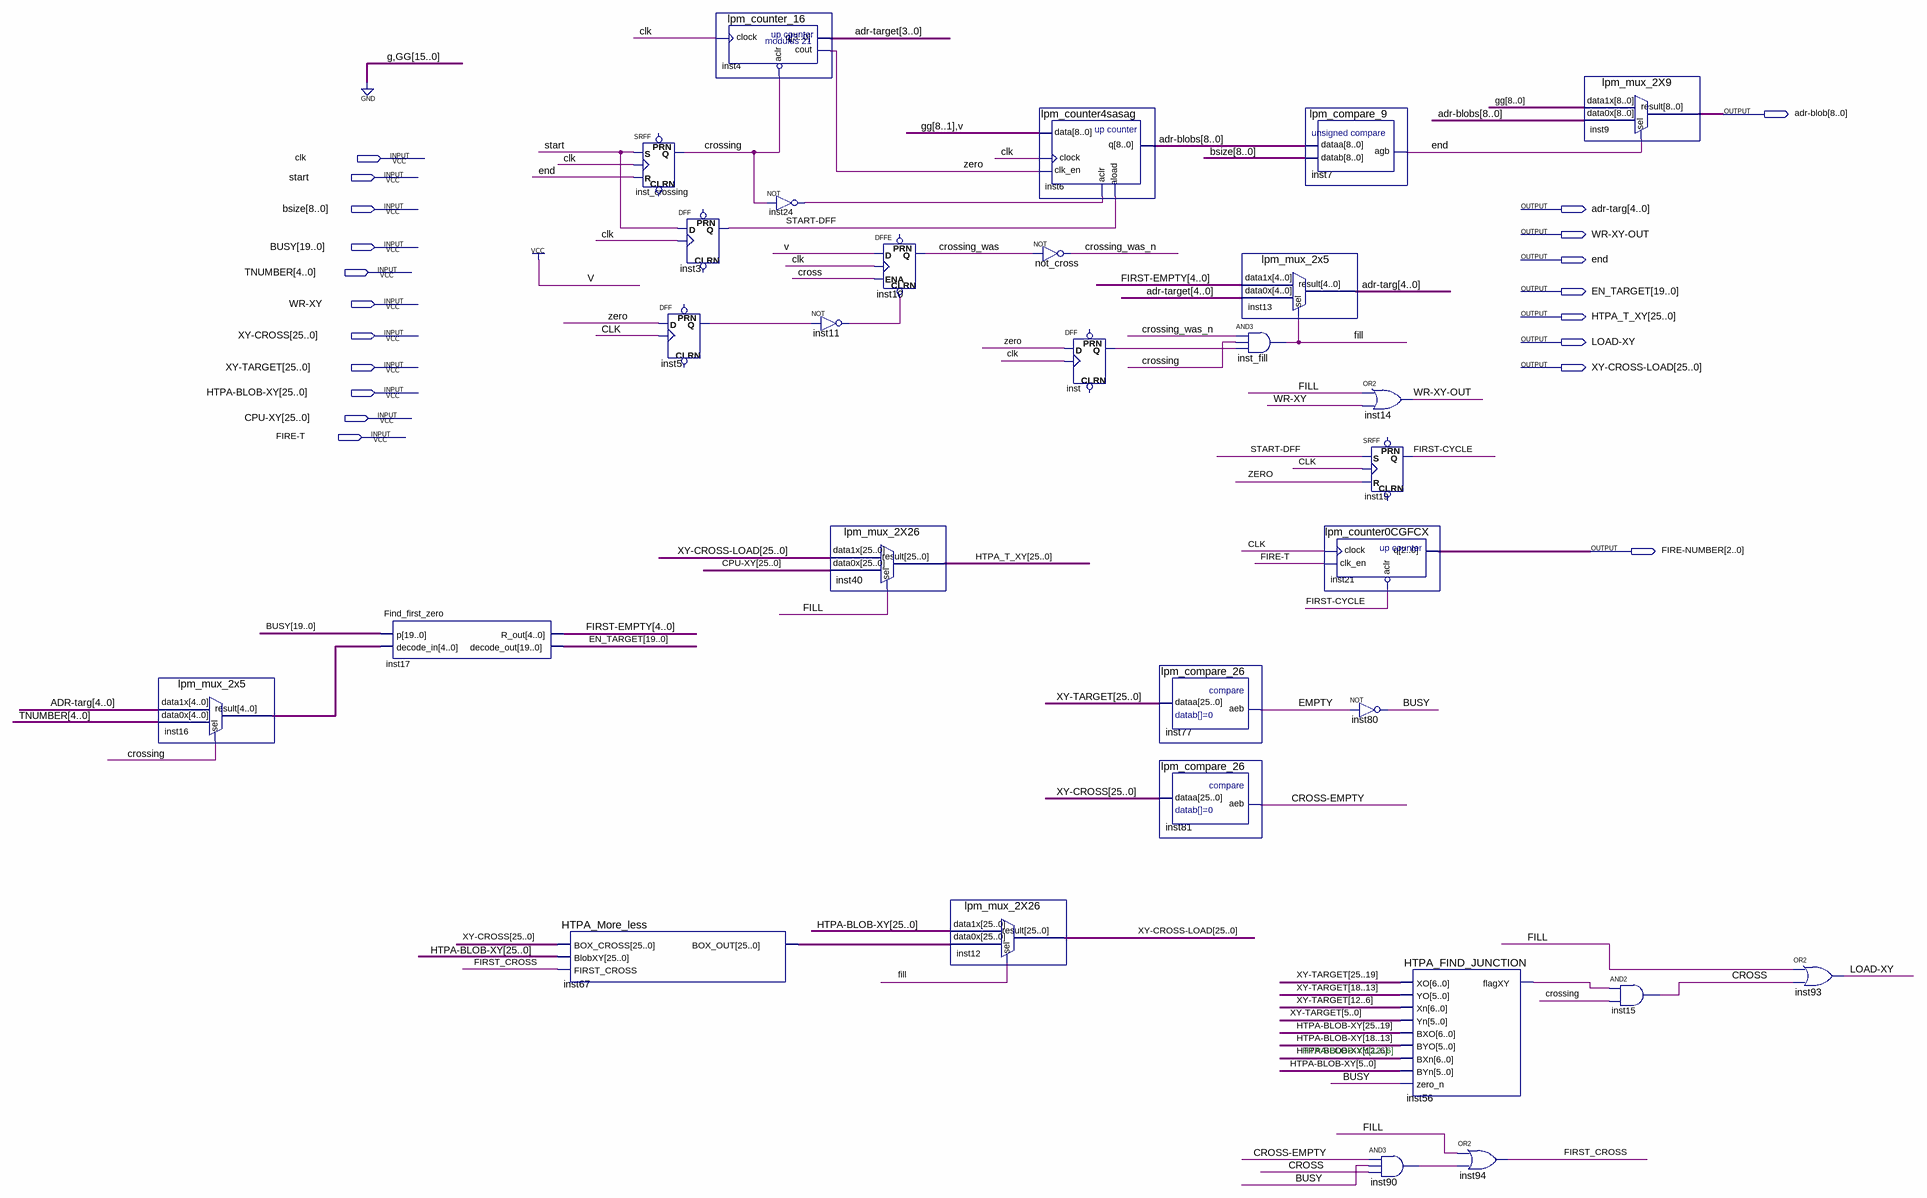
[diagram p0: schematic sheet]
// Quartus schematic cross_cpu.bdf as structural Verilog: 30 symbols, 20 pins
module cross_cpu (
  input  clk,
  input  start,
  input  [8:0] bsize,
  input  [19:0] BUSY,
  input  [4:0] TNUMBER,
  input  \WR-XY ,
  input  [25:0] \XY-CROSS ,
  input  [25:0] \XY-TARGET ,
  input  [25:0] \HTPA-BLOB-XY ,
  input  [25:0] \CPU-XY ,
  input  \FIRE-T ,
  output [8:0] \adr-blob ,
  output [4:0] \adr-targ ,
  output \WR-XY-OUT ,
  output \end ,
  output [19:0] EN_TARGET,
  output [25:0] HTPA_T_XY,
  output \LOAD-XY ,
  output [25:0] \XY-CROSS-LOAD ,
  output [2:0] \FIRE-NUMBER 
);

  wire BUSY_1bit, \cross , \CROSS-EMPTY , crossing, crossing_was, crossing_was_n, EMPTY, FILL, \FIRST-CYCLE ,
       FIRST_CROSS, inst5_q, inst11_out, inst24_out, inst56_flagxy, inst90_out, inst_q, \START-DFF , zero;
  wire [4:0] \adr-target , \FIRST-EMPTY , inst16_result;
  wire [8:0] \adr-blobs ;
  wire [25:0] inst67_box_out;

  lpm_mux_2x5 inst16 (.data1x(\adr-targ ), .data0x(TNUMBER), .sel(crossing), .result(inst16_result));
  Find_first_zero inst17 (.p(BUSY), .decode_in(inst16_result), .R_out(\FIRST-EMPTY ), .decode_out(EN_TARGET));
  HTPA_More_less inst67 (
    .BOX_CROSS(\XY-CROSS ), .BlobXY(\HTPA-BLOB-XY ), .FIRST_CROSS(FIRST_CROSS), .BOX_OUT(inst67_box_out));
  SRFF inst_crossing (.S(start), .R(\end ), .CLK(clk), .Q(crossing));  // open: PRN, CLRN
  DFF inst3 (.CLK(clk), .D(start), .Q(\START-DFF ));  // open: CLRN, PRN
  DFF inst5 (.CLK(clk), .D(zero), .Q(inst5_q));  // open: CLRN, PRN
  lpm_counter_16 inst4 (.clock(clk), .aclr(~crossing), .cout(zero), .q(\adr-target [3:0]));
  not inst24 (inst24_out, crossing);
  not inst11 (inst11_out, inst5_q);
  lpm_mux_2X26 inst40 (.data1x(\XY-CROSS-LOAD ), .data0x(\CPU-XY ), .sel(FILL), .result(HTPA_T_XY));
  DFFE inst10 (.CLRN(inst11_out), .D(1'b1), .CLK(clk), .ENA(\cross ), .Q(crossing_was));  // open: PRN
  lpm_mux_2X26 inst12 (.data1x(\HTPA-BLOB-XY ), .data0x(inst67_box_out), .sel(FILL), .result(\XY-CROSS-LOAD ));
  lpm_counter4sasag inst6 (
    .aclr(inst24_out), .aload(\START-DFF ), .clk_en(zero), .clock(clk), .data(9'b000000001), .q(\adr-blobs ));
  not not_cross (crossing_was_n, crossing_was);
  DFF inst (.CLK(clk), .D(zero), .Q(inst_q));  // open: CLRN, PRN
  lpm_compare_26 inst77 (.dataa(\XY-TARGET ), .aeb(EMPTY));
  lpm_compare_26 inst81 (.dataa(\XY-CROSS ), .aeb(\CROSS-EMPTY ));
  lpm_mux_2x5 inst13 (.data1x(\FIRST-EMPTY ), .data0x(\adr-target ), .sel(FILL), .result(\adr-targ ));
  and inst_fill (FILL, crossing_was_n, crossing, inst_q);
  lpm_compare_9 inst7 (.dataa(\adr-blobs ), .datab(bsize), .agb(\end ));
  lpm_counter0CGFCX inst21 (.clock(clk), .clk_en(\FIRE-T ), .aclr(~\FIRST-CYCLE ), .q(\FIRE-NUMBER ));
  not inst80 (BUSY_1bit, EMPTY);
  or inst14 (\WR-XY-OUT , FILL, \WR-XY );
  SRFF inst19 (.S(\START-DFF ), .R(zero), .CLK(clk), .Q(\FIRST-CYCLE ));  // open: PRN, CLRN
  HTPA_FIND_JUNCTION inst56 (
    .XO(\XY-TARGET [25:19]), .YO(\XY-TARGET [18:13]), .Xn(\XY-TARGET [12:6]), .Yn(\XY-TARGET [5:0]),
    .BXO(\HTPA-BLOB-XY [25:19]), .BYO(\HTPA-BLOB-XY [18:13]), .BXn(\HTPA-BLOB-XY [12:6]),
    .BYn(\HTPA-BLOB-XY [5:0]), .zero_n(BUSY_1bit), .flagXY(inst56_flagxy));
  and inst90 (inst90_out, \CROSS-EMPTY , BUSY_1bit, \cross );
  or inst94 (FIRST_CROSS, FILL, inst90_out);
  lpm_mux_2X9 inst9 (.data1x({9{1'b0}}), .data0x(\adr-blobs ), .sel(\end ), .result(\adr-blob ));
  and inst15 (\cross , inst56_flagxy, crossing);
  or inst93 (\LOAD-XY , FILL, \cross );

  // Notes on the sheet:
  //   HTPA-BLOB-XY[12..6]
endmodule
